# Altium project PhantomPowerSupply_PCBProject.PrjPcb
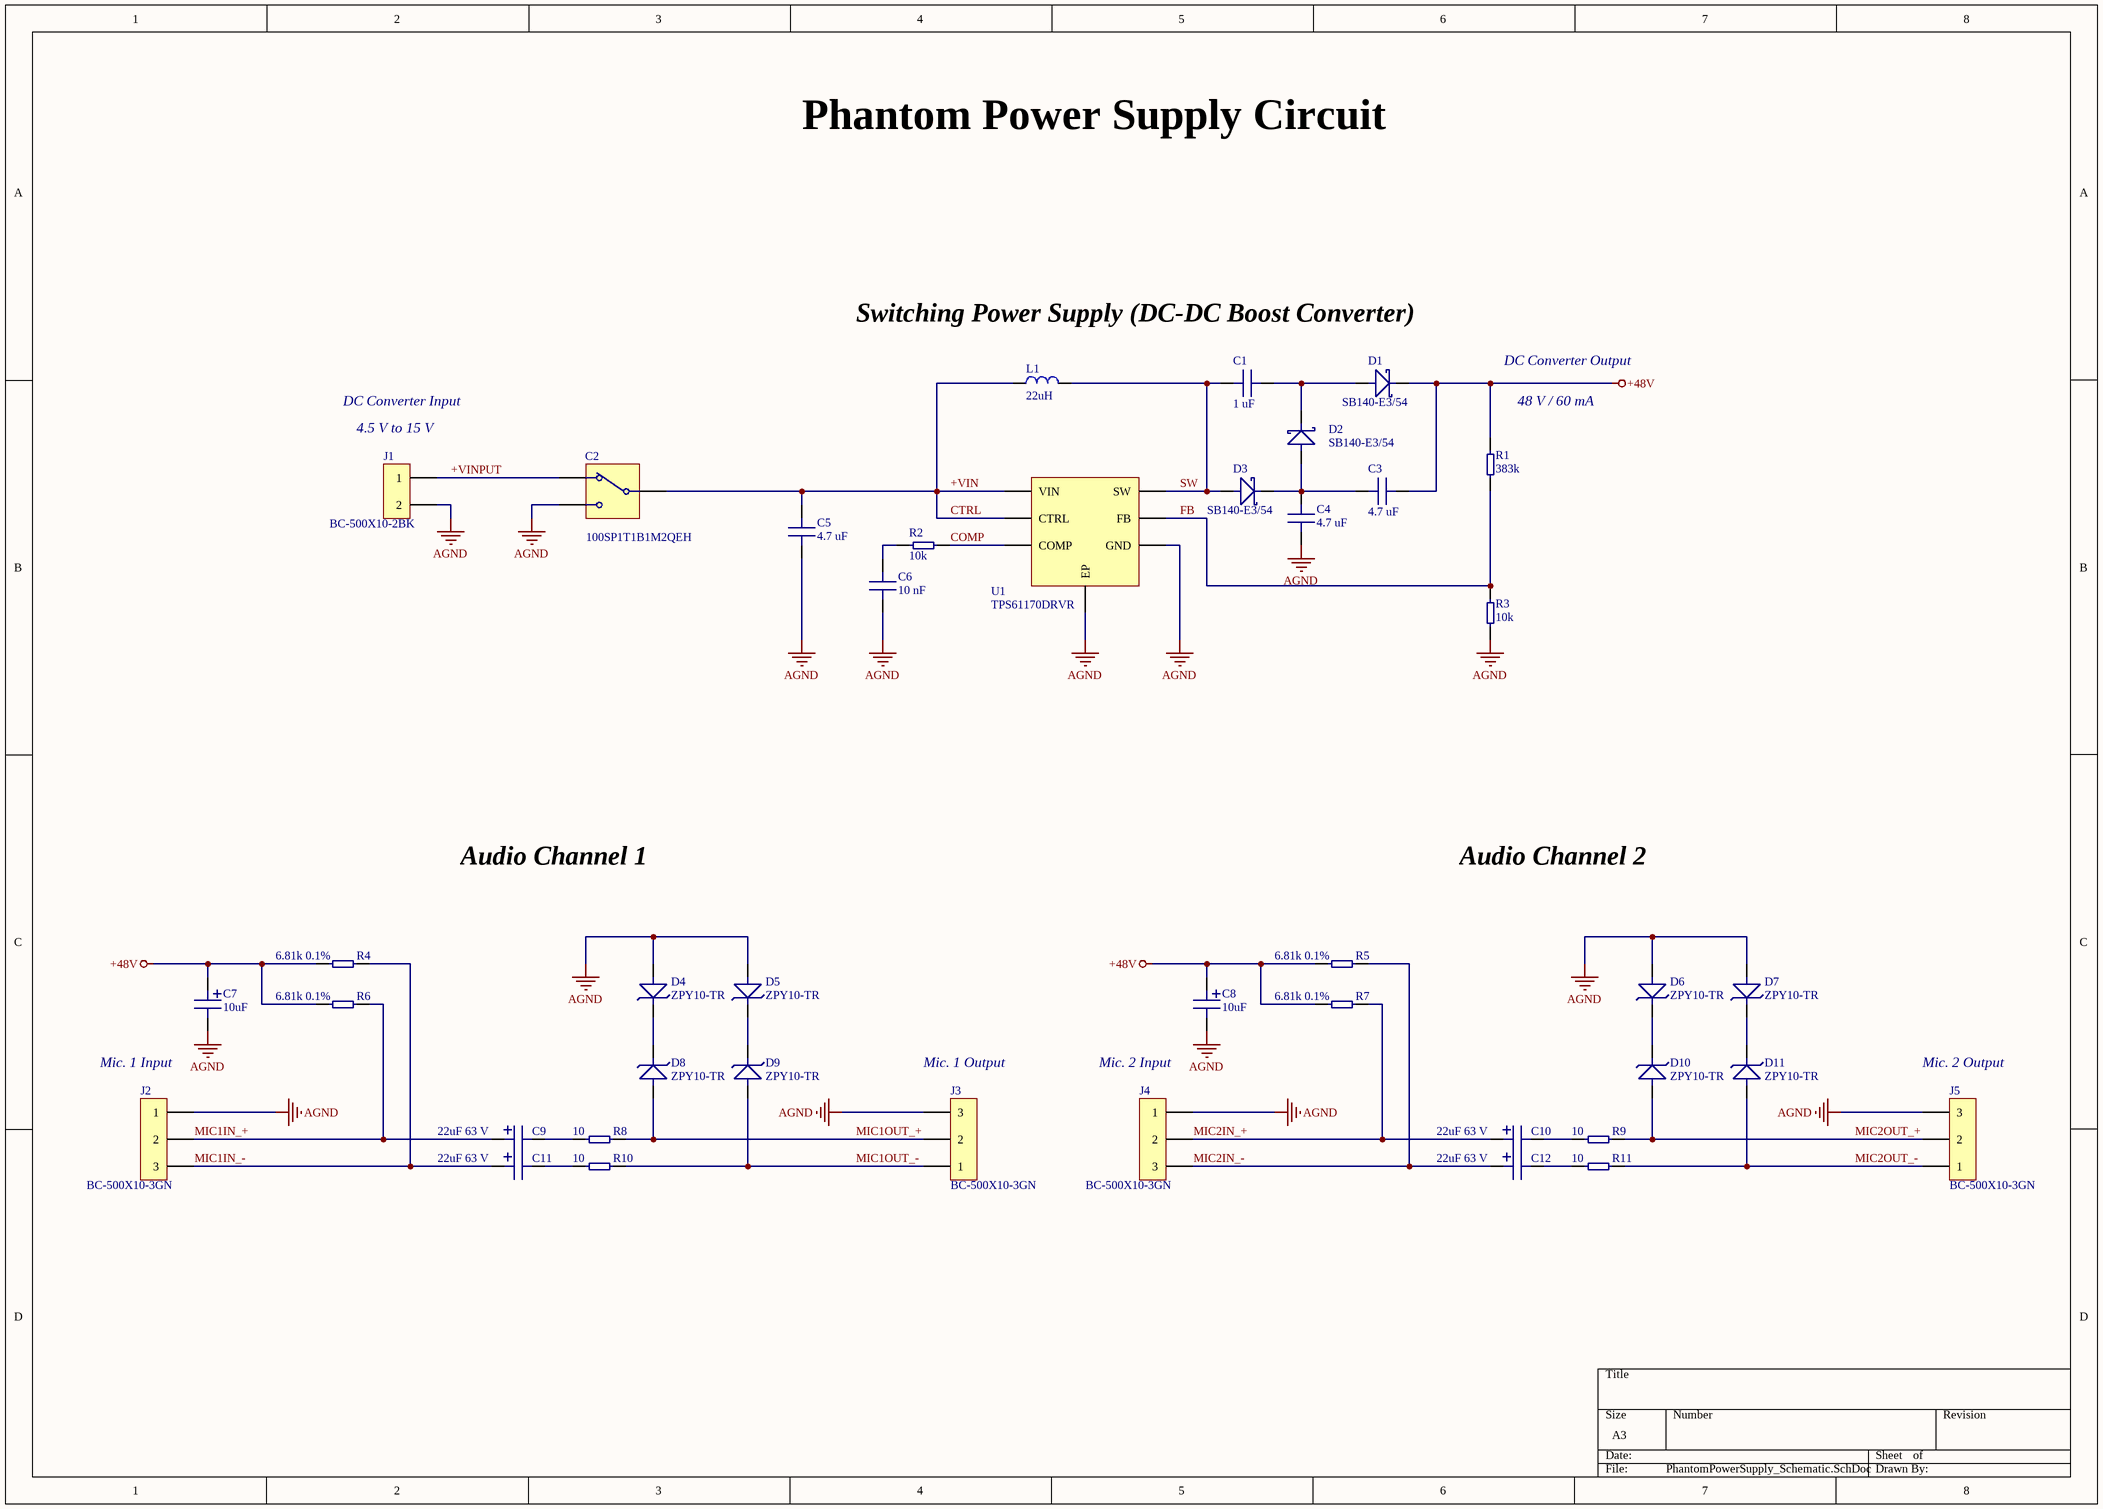
[diagram p0: PhantomPowerSupply_Schematic.SchDoc]
1 sheet, 41 parts. Net scope: global (net labels, ports and power ports of the same name join across sheets).
Board file: PhantomPowerSupply_Board.PcbDoc

## Sheet PhantomPowerSupply_Schematic.SchDoc
size A3

### Parts
C1  1 uF  [CRADIAL-CERAMIC-BROWN]
C2  100SP1T1B1M2QEH  [SPDT-M2]
C3  4.7 uF  [CRADIAL-CERAMIC]
C4  4.7 uF  [CRADIAL-CERAMIC]
C5  4.7 uF  [CRADIAL-CERAMIC]
C6  10 nF  [CRADIAL-CERAMIC-BROWN]
C7  10uF  [C-ELECTROLYTIC-RADIAL]
C8  10uF  [C-ELECTROLYTIC-RADIAL]
C9  22uF 63 V  [C-ELECTROLYTIC-RADIAL]
C10  22uF 63 V  [C-ELECTROLYTIC-RADIAL]
C11  22uF 63 V  [C-ELECTROLYTIC-RADIAL]
C12  22uF 63 V  [C-ELECTROLYTIC-RADIAL]
D1  SB140-E3/54  [D-SCHOTTKY-AXIAL]
D2  SB140-E3/54  [D-SCHOTTKY-AXIAL]
D3  SB140-E3/54  [D-SCHOTTKY-AXIAL]
D4  ZPY10-TR  [D-ZENER-AXIAL]
D5  ZPY10-TR  [D-ZENER-AXIAL]
D6  ZPY10-TR  [D-ZENER-AXIAL]
D7  ZPY10-TR  [D-ZENER-AXIAL]
D8  ZPY10-TR  [D-ZENER-AXIAL]
D9  ZPY10-TR  [D-ZENER-AXIAL]
D10  ZPY10-TR  [D-ZENER-AXIAL]
D11  ZPY10-TR  [D-ZENER-AXIAL]
J1  BC-500X10-2BK  [SCREW-CON-2POS]
J2  BC-500X10-3GN  [SCREW-CON-3POS]
J3  BC-500X10-3GN  [SCREW-CON-3POS]
J4  BC-500X10-3GN  [SCREW-CON-3POS]
J5  BC-500X10-3GN  [SCREW-CON-3POS]
L1  22uH  [L-AXIAL]
R1  383k  [R-AXIAL]
R2  10k  [R-AXIAL]
R3  10k  [R-AXIAL]
R4  6.81k 0.1%  [R-AXIAL]
R5  6.81k 0.1%  [R-AXIAL]
R6  6.81k 0.1%  [R-AXIAL]
R7  6.81k 0.1%  [R-AXIAL]
R8  10  [R-AXIAL]
R9  10  [R-AXIAL]
R10  10  [R-AXIAL]
R11  10  [R-AXIAL]
U1  TPS61170DRVR  [S-PWSON-N6]

### Nets
+48V: C3.2 C7.1 C8.1 D1.2 R1.2 R4.1 R5.1 R6.1 R7.1
AGND: C2.3 C4.1 C5.1 C6.1 C7.2 C8.2 D4.1 D5.1 D6.1 D7.1 J1.2 J2.1 J3.3 J4.1 J5.3 R3.1 U1.3(GND) U1.7(EP)
+VIN: C2.2 C5.2 L1.1 U1.5(CTRL) U1.6(VIN)  [also labelled CTRL]
+VINPUT: C2.1 J1.1
COMP: R2.2 U1.2(COMP)
FB: R1.1 R3.2 U1.1(FB)
MIC1IN_+: C9.1 J2.2 R6.2
MIC1IN_-: C11.1 J2.3 R4.2
MIC1OUT_+: D8.1 J3.2 R8.2
MIC1OUT_-: D9.1 J3.1 R10.2
MIC2IN_+: C10.1 J4.2 R7.2
MIC2IN_-: C12.1 J4.3 R5.2
MIC2OUT_+: D10.1 J5.2 R9.2
MIC2OUT_-: D11.1 J5.1 R11.2
SW: C1.1 D3.1 L1.2 U1.4(SW)
NetC1_2: C1.2 D1.1 D2.2
NetC3_1: C3.1 C4.2 D2.1 D3.2
NetC6_2: C6.2 R2.1
NetC9_2: C9.2 R8.1
NetC10_2: C10.2 R9.1
NetC11_2: C11.2 R10.1
NetC12_2: C12.2 R11.1
NetD4_2: D4.2 D8.2
NetD5_2: D5.2 D9.2
NetD6_2: D6.2 D10.2
NetD7_2: D7.2 D11.2

### Notes on the sheet
- Phantom Power Supply Circuit
- Switching Power Supply (DC-DC Boost Converter)
- DC Converter Output
- DC Converter Input
- (near J1) 4.5 V to 15 V
- (near R1) 48 V / 60 mA
- Audio Channel 1
- Audio Channel 2
- Mic. 1 Input
- (near J3) Mic. 1 Output
- Mic. 2 Input
- (near J5) Mic. 2 Output

### Library data of the parts
C1 = K105K20X7RF5TH5: Multilayer Ceramic Capacitors MLCC - Leaded 1uF 50volts 10% X7R 5mm LS; Manufacturer: Vishay / BC Components; Voltage Rating: 50 V; Case Style: Dipped; Lead Diameter: 0.5 mm; Supplier 1: Mouser; Manufacturer Part Number: K105K20X7RF5TH5; RoHS: RoHS Compliant By Exemption; Category: Multilayer Ceramic Capacitors MLCC - Leaded; Stock 1: 11553; Pricing 1: 1=0.312, 3000=0.166, 6000=0.150, 15000=0.141, 30000=0.131 (EUR); Capacitance: 1 uF; Operating Temperature Range: - 55 C to + 125 C; Packaging: Reel; Product: General Type MLCCs; Series: K; Termination Style: Radial; Tolerance: 10 %; Voltage Rating DC: 50 V; Brand: Vishay / BC Components; Case Height: 5 mm; Case Length: 5 mm; Case Width: 5 mm; Lead Spacing: 5 mm; Lead Style: Outside Bend; Maximum Operating Temperature: + 125 C; Minimum Operating Temperature: - 55 C; Product Category: Ceramic Capacitors; Temperature Coefficient/Code: X7R; Tradename: Mono-Kap; RoHS - Mouser: E; Minimum Order Quantity: 1; Reeling: True; ComponentLink1URL: http://www.mouser.com/ds/2/427/mkseries-205465.pdf; ComponentLink1Description: http://www.mouser.com/ds/2/427/mkseries-205465.pdf
C2 = 100SP1T1B1M2QEH: Toggle Switches SPDT ON-ON PC MNT; Manufacturer: E-Switch; Actuator: Bat; Current Rating: 4 A; Illumination: None; Switch Function: ON - NONE - ON; Voltage Rating AC: 250 V; Voltage Rating DC: 28 V; Supplier 1: Mouser; Manufacturer Part Number: 100SP1T1B1M2QEH; RoHS: RoHS Compliant; Category: Toggle Switches; Stock 1: 1386; Pricing 1: 1=1.69, 10=1.62, 25=1.54, 50=1.48, 100=1.34, 250=1.23, 500=1.13 (EUR); Bushing Size: 1/4-40; Contact Form: SPDT; Contact Plating: Silver; Series: 100; Terminal Seal: Sealed; Termination Style: Solder Pin; Brand: E-Switch; Mounting Style: Through Hole; Product Category: Toggle Switches; RoHS - Mouser: Y; Minimum Order Quantity: 1; Reeling: False; ComponentLink1URL: http://www.mouser.com/ds/2/140/100-346274.pdf; ComponentLink1Description: http://www.mouser.com/ds/2/140/100-346274.pdf
C3-C5 = FK11X7R1H475K: Multilayer Ceramic Capacitors MLCC - Leaded 4.7uF 50volts X7R +/-10%; Manufacturer: TDK; Tolerance: 10 %; Type: Dipped Radial Lead Commercial Grade; Voltage Rating: 50 V; Case Style: Dipped; Case Height: 4 mm; Case Length: 5.5 mm; Case Width: 7 mm; Lead Diameter: 0.5 mm; Supplier 1: Mouser; Manufacturer Part Number: FK11X7R1H475K; RoHS: RoHS Compliant; Category: Multilayer Ceramic Capacitors MLCC - Leaded; Stock 1: 12031; Pricing 1: 1=0.784, 10=0.602, 100=0.334, 1000=0.287, 2500=0.254, 10000=0.246, 25000=0.236, 50000=0.231 (EUR); Capacitance: 4.7 uF; Operating Temperature Range: - 55 C to + 125 C; Packaging: Bulk; Product: General Type MLCCs; Series: FK; Termination Style: Radial; Voltage Rating DC: 50 V; Brand: TDK; Lead Spacing: 2.5 mm; Maximum Operating Temperature: + 125 C; Minimum Operating Temperature: - 55 C; Standard Pack Qty: 500; Temperature Coefficient/Code: X7R; RoHS - Mouser: Y; Minimum Order Quantity: 1; Reeling: False; ComponentLink1URL: http://www.mouser.com/ds/2/400/tdk_lowvoltageleadmlcc_commercial_general_en-347111.pdf; ComponentLink1Description: http://www.mouser.com/ds/2/400/tdk_lowvoltageleadmlcc_commercial_general_en-347111.pdf
C6 = K103K15X7RF5UH5: Multilayer Ceramic Capacitors MLCC - Leaded .01uF 50volts 10% 5.0mm X7R; Manufacturer: Vishay / BC Components; Capacitance: 0.01 uF; Voltage Rating: 50 V; Case Style: Dipped; Case Width: 2.5 mm; Product Status: New at Mouser; Supplier 1: Mouser; Manufacturer Part Number: K103K15X7RF5UH5; RoHS: RoHS Compliant; Category: Multilayer Ceramic Capacitors MLCC - Leaded; Stock 1: 19645; Pricing 1: 1=0.032, 100=0.024, 2500=0.024, 5000=0.016 (EUR); Operating Temperature Range: - 55 C to + 125 C; Packaging: Ammo Pack; Product: General Type MLCCs; Termination Style: Radial; Tolerance: 10 %; Voltage Rating DC: 50 V; Brand: Vishay / BC Components; Maximum Operating Temperature: + 125 C; Minimum Operating Temperature: - 55 C; Product Category: Dipped Radial Ceramic Capacitor; Standard Pack Qty: 2500; RoHS - Mouser: Y; Minimum Order Quantity: 1; Reeling: False; ComponentLink1URL: http://www.mouser.com/catalog/specsheets/mkseries.pdf; ComponentLink1Description: http://www.mouser.com/catalog/specsheets/mkseries.pdf
C7 C8 = REA100M1HBK-0511P: Aluminium Electrolytic Capacitors - Leaded 50V 10uF 20% 5x11mm; Manufacturer: Lelon; Case Diameter: 5 mm; Case Length: 11 mm; Dissipation Factor DF: 0.1; Load Life: 2000 h; Ripple Current: 65 mA; Supplier 1: Mouser; Manufacturer Part Number: REA100M1HBK-0511P; RoHS: RoHS Compliant; Category: Aluminium Electrolytic Capacitors - Leaded; Stock 1: 39187; Pricing 1: 1=0.064, 10=0.062, 100=0.054, 500=0.041, 1000=0.039, 2000=0.032, 5000=0.028, 10000=0.025, 25000=0.017 (EUR); Capacitance: 10 uF; Dimensions: 5 mm Dia. x 11 mm L; Product: General Purpose Electrolytic Capacitors; Series: REA; Termination Style: Radial; Tolerance: 20 %; Voltage Rating DC: 50 V; Brand: Lelon; Lead Spacing: 2 mm; Maximum Operating Temperature: + 85 C; Product Category: Radial Electrolytic Capacitors; Standard Pack Qty: 500; RoHS - Mouser: Y; Minimum Order Quantity: 1; Reeling: False; ComponentLink1URL: http://www.mouser.com/catalog/specsheets/lelon_REA[1].pdf; ComponentLink1Description: http://www.mouser.com/catalog/specsheets/lelon_REA[1].pdf
C9-C12 = REA220M1JBK-0611P: Aluminium Electrolytic Capacitors - Leaded 63V 22uF 20% 6.3x11 mm; Manufacturer: Lelon; Case Diameter: 6.3 mm; Case Length: 11 mm; Dissipation Factor DF: 0.09; Load Life: 2000 h; Ripple Current: 115 mA; Product Status: Factory Special Order; Supplier 1: Mouser; Manufacturer Part Number: REA220M1JBK-0611P; RoHS: RoHS Compliant; Category: Aluminium Electrolytic Capacitors - Leaded; Stock 1: 9296; Pricing 1: 1=0.072, 10=0.066, 100=0.053, 500=0.040, 1000=0.038, 2000=0.033, 5000=0.027, 10000=0.024, 25000=0.022 (EUR); Capacitance: 22 uF; Dimensions: 6.3 mm Dia. x 11 mm L; Packaging: Bulk; Product: General Purpose Electrolytic Capacitors; Series: REA; Termination Style: Radial; Tolerance: 20 %; Voltage Rating DC: 63 V; Brand: Lelon; Lead Spacing: 2.5 mm; Maximum Operating Temperature: + 85 C; Product Category: Radial Electrolytic Capacitors; Standard Pack Qty: 1000; RoHS - Mouser: Y; Minimum Order Quantity: 1; Reeling: False; ComponentLink1URL: http://www.mouser.com/catalog/specsheets/lelon_REA[1].pdf; ComponentLink1Description: http://www.mouser.com/catalog/specsheets/lelon_REA[1].pdf
D1-D3 = SB140-E3/54: Schottky Diodes & Rectifiers 40 Volt 1.0 Amp 50 Amp IFSM; Manufacturer: Vishay Semiconductors; Configuration: Single; Forward Continuous Current: 1 A; Max Surge Current: 50 A; Forward Voltage Drop: 0.48 V; Maximum Reverse Leakage Current: 500 uA; Peak Reverse Voltage: 40 V; Supplier 1: Mouser; Manufacturer Part Number: SB140-E3/54; RoHS: RoHS Compliant By Exemption; Category: Schottky Diodes & Rectifiers; Stock 1: 11660; Pricing 1: 1=0.096, 5500=0.096 (EUR); Operating Temperature Range: - 65 C to + 125 C; Package/Case: DO-204AL; Packaging: Reel; Product: Schottky Diodes; Brand: Vishay Semiconductors; Mounting Style: Through Hole; Product Category: Schottky Rectifiers; Standard Pack Qty: 5500; RoHS - Mouser: E; Minimum Order Quantity: 1; Reeling: True; ComponentLink1URL: http://www.mouser.com/ds/2/427/88715-108282.pdf; ComponentLink1Description: http://www.mouser.com/ds/2/427/88715-108282.pdf
D4-D11 = ZPY10-TR: Zener Diodes 10 Volt 1.3 Watt 5%; Manufacturer: Vishay Semiconductors; Configuration: Single; Power Dissipation: 1.3 W; Zener Current: 105 mA; Maximum Zener Impedance: 4 Ohms; Voltage Temperature Coefficient: 0.07 %/C; Voltage Tolerance: 6 %; Zener Voltage: 10.005 V; Supplier 1: Mouser; Manufacturer Part Number: ZPY10-TR; RoHS: RoHS Compliant By Exemption; Category: Zener Diodes; Stock 1: 17165; Pricing 1: 1=0.080, 10=0.056, 100=0.055, 500=0.047, 1000=0.046, 5000=0.045, 10000=0.042, 25000=0.039 (EUR); Package/Case: DO-41; Packaging: Reel; Brand: Vishay Semiconductors; Mounting Style: Through Hole; Maximum Operating Temperature: + 175 C; Minimum Operating Temperature: - 55 C; Product Category: Zener Diodes; Standard Pack Qty: 5000; RoHS - Mouser: E; Minimum Order Quantity: 1; Reeling: True; ComponentLink1URL: http://www.mouser.com/ds/2/427/zpy3v9-108163.pdf; ComponentLink1Description: http://www.mouser.com/ds/2/427/zpy3v9-108163.pdf
J1 = 5441537: Fixed Terminal Blocks BC-500X10- 2 BK; Manufacturer: Phoenix Contact; Connection Method: Screw; Current Rating: 13.5 A; Number of Positions: 2; Voltage Rating: 400 V; Pitch: 5 mm; Wire Gauge Range: 26-16; Wire Gauge Max: 16; Wire Gauge Min: 26; Product Status: New Product; Supplier 1: Mouser; Manufacturer Part Number: 5441537; RoHS: RoHS Compliant; Category: Fixed Terminal Blocks; Stock 1: 88; Pricing 1: 1=0.704, 10=0.672, 25=0.664, 50=0.656, 100=0.614, 250=0.565, 500=0.522, 1000=0.499 (EUR); Color: Black; Contact Plating: Tin; Housing Material: Polyamide (PA); Length: 5 mm; Mounting Method: -; Series: BC; Termination Style: Through Hole; Brand: Phoenix Contact; Flammability Rating: UL 94 V-0; Standard Pack Qty: 100; Tradename: BASICLINE; RoHS - Mouser: Y; Minimum Order Quantity: 1; Reeling: False; ComponentLink1URL: http://www.phoenixcontact.com/us/products/5441537/pdf; ComponentLink1Description: http://www.phoenixcontact.com/us/products/5441537/pdf
J2-J5 = 5442183: Fixed Terminal Blocks BC-500X10- 3 GN 5.00 MM PITCH; Manufacturer: Phoenix Contact; Connection Method: Screw; Current Rating: 13.5 A; Number of Positions: 3; Voltage Rating: 400 V; Pitch: 5 mm; Wire Gauge Range: 26-16; Wire Orientation: 0 deg; Product Status: New Product; Supplier 1: Mouser; Manufacturer Part Number: 5442183; RoHS: RoHS Compliant; Category: Fixed Terminal Blocks; Stock 1: 314; Pricing 1: 1=1.04, 10=1.00, 25=0.984, 50=0.976, 100=0.912, 250=0.840, 500=0.776, 1000=0.742 (EUR); Color: Green; Contact Plating: Tin; Series: BC; Termination Style: Through Hole; Brand: Phoenix Contact; Flammability Rating: UL 94 V-0; Standard Pack Qty: 100; Tradename: BASICLINE; RoHS - Mouser: Y; Minimum Order Quantity: 1; Reeling: False; ComponentLink1URL: http://www.phoenixcontact.com/us/products/5442183/pdf; ComponentLink1Description: http://www.phoenixcontact.com/us/products/5442183/pdf
L1 = 78F220J-RC: Fixed Inductors 22uH 5%; Manufacturer: J.W. Miller; Core Material: Ferrite; Maximum DC Current: 285 mA; Maximum DC Resistance: 1.2 Ohms; Q Minimum: 50; Self Resonant Frequency: 13 MHz; Type: Conformal Coated Chokes; Case Diameter: 0.11 in; Case Length: 0.28 in; Test Frequency: 2.5 MHz; Supplier 1: Mouser; Manufacturer Part Number: 78F220J-RC; RoHS: RoHS Compliant; Category: Fixed Inductors; Stock 1: 8659; Pricing 1: 1=0.176, 10=0.138, 100=0.108, 500=0.092, 1000=0.078 (EUR); Inductance: 22 uH; Operating Temperature Range: - 20 C to + 105 C; Series: 78F; Termination Style: Axial; Tolerance: 5 %; Brand: J.W. Miller; Product Category: Conformal Coated Chokes; Standard Pack Qty: 5000; RoHS - Mouser: Y; Minimum Order Quantity: 1; Reeling: False; ComponentLink1URL: http://www.mouser.com/ds/2/54/78F_series-42602.pdf; ComponentLink1Description: http://www.mouser.com/ds/2/54/78F_series-42602.pdf
R1 = MF1/4DCT26A3833F: Metal Film Resistors - Through Hole 1/4 WATT 383K OHM 1%; Manufacturer: KOA Speer; Power Rating: 250 mW (1/4 W); Resistance: 383 kOhms; Temperature Coefficient: 100 PPM / C; Case Diameter: 2.3 mm; Case Length: 7.1 mm; Supplier 1: Mouser; Manufacturer Part Number: MF1/4DCT26A3833F; RoHS: RoHS Compliant; Category: Metal Film Resistors - Through Hole; Stock 1: 5660; Pricing 1: 1=0.064, 100=0.032, 1000=0.022, 2000=0.022, 4000=0.016, 10000=0.012, 24000=0.009, 50000=0.006, 250000=0.005 (EUR); Operating Temperature Range: - 55 C to + 155 C; Packaging: Ammo Pack; Product: Metal Film Resistors General Purpose; Series: MF; Termination Style: Axial; Tolerance: 1 %; Type: Semi-precision metal film resistors; Brand: KOA Speer; Lead Spacing: 30 mm; Product Category: 1/4Watt Metal Film Resistors; Standard Pack Qty: 2000; RoHS - Mouser: Y; Minimum Order Quantity: 1; Reeling: False; ComponentLink1URL: http://www.koaspeer.com/catimages/Products/MF-MFS-RK/MF-MFS-RK.pdf; ComponentLink1Description: http://www.koaspeer.com/catimages/Products/MF-MFS-RK/MF-MFS-RK.pdf
R2 R3 = MF1/4DCT52A1002F: Metal Film Resistors - Through Hole 1/4 WATT 10K OHM 1%; Manufacturer: KOA Speer; Power Rating: 250 mW (1/4 W); Resistance: 10 kOhms; Temperature Coefficient: 100 PPM / C; Case Diameter: 2.3 mm; Case Length: 7.1 mm; Supplier 1: Mouser; Manufacturer Part Number: MF1/4DCT52A1002F; RoHS: RoHS Compliant; Category: Metal Film Resistors - Through Hole; Stock 1: 62471; Pricing 1: 1=0.064, 100=0.032, 1000=0.022, 5000=0.016, 10000=0.012, 25000=0.009, 50000=0.006, 250000=0.005 (EUR); Packaging: Ammo Pack; Product: Metal Film Resistors General Purpose; Termination Style: Axial; Tolerance: 1 %; Brand: KOA Speer; Product Category: 1/4Watt Metal Film Resistors; Standard Pack Qty: 5000; RoHS - Mouser: Y; Minimum Order Quantity: 1; Reeling: False; ComponentLink1URL: http://www.koaspeer.com/catimages/Products/MF-MFS-RK/MF-MFS-RK.pdf; ComponentLink1Description: http://www.koaspeer.com/catimages/Products/MF-MFS-RK/MF-MFS-RK.pdf
R4-R7 = RN55E6811BRE6: Metal Film Resistors - Through Hole 1/10watt 6.81Kohms .1% 25ppm; Manufacturer: Vishay / Dale; Power Rating: 125 mW (1/8 W); Temperature Coefficient: 25 PPM / C; Voltage Rating: 200 V; Case Diameter: 2.29 mm; Case Length: 6.1 mm; Lead Diameter: 0.64 mm; Supplier 1: Mouser; Manufacturer Part Number: RN55E6811BRE6; RoHS: No; Category: Metal Film Resistors - Through Hole; Stock 1: 823; Pricing 1: 1=0.416, 50=0.376, 100=0.320, 500=0.304, 1000=0.288, 2000=0.240, 5000=0.216 (EUR); Operating Temperature Range: - 65 C to + 175 C; Packaging: Reel; Product: Precision Metal Film Resistors; Resistance: 6.81 kOhms; Series: RN; Termination Style: Axial; Tolerance: 0.1 %; Type: Military Precision Metal Film Resistors; Brand: Vishay / Dale; Product Category: Metal Film Resistors; Standard Pack Qty: 1000; RoHS - Mouser: N; Minimum Order Quantity: 1; Reeling: True; ComponentLink1URL: http://www.vishay.com/doc?31027; ComponentLink1Description: http://www.vishay.com/doc?31027
R8-R11 = FRM-50JT-52-10R: Metal Film Resistors - Through Hole 10 OHM 1/2W 5%; Manufacturer: Yageo; Power Rating: 500 mW (1/2 W); Resistance: 10 Ohms; Temperature Coefficient: 200 PPM / C; Voltage Rating: 250 V; Case Diameter: 3.3 mm; Case Length: 9 mm; Lead Diameter: 0.55 mm; Supplier 1: Mouser; Manufacturer Part Number: FRM-50JT-52-10R; RoHS: RoHS Compliant; Category: Metal Film Resistors - Through Hole; Stock 1: 3950; Pricing 1: 1=0.032, 1000=0.024, 2000=0.017, 5000=0.015, 25000=0.014, 100000=0.013 (EUR); Operating Temperature Range: - 55 C to + 155 C; Packaging: Ammo Pack; Product: Metal Film Resistors Flameproof; Series: FRM; Termination Style: Axial; Tolerance: 5 %; Type: Fusible and Flame Proof Type Normal and Miniature Style; Brand: Yageo; Product Category: Metal Film Resistors; RoHS - Mouser: Y; Minimum Order Quantity: 1; Reeling: False; ComponentLink1URL: http://www.mouser.com/ds/2/447/Leaded-R_2011-336584.pdf; ComponentLink1Description: http://www.mouser.com/ds/2/447/Leaded-R_2011-336584.pdf
U1 = TPS61170DRVR: Voltage Regulators - Switching Regulators 1.2A Sw Hi Vltg Boost Conv; Manufacturer: Texas Instruments; Input Voltage MAX: 18 V; Number of Outputs: 1 Output; Output Voltage: 3 V to 38 V; Switching Frequency: 1.2 MHz; Supplier 1: Mouser; Manufacturer Part Number: TPS61170DRVR; RoHS: RoHS Compliant; Category: Voltage Regulators - Switching Regulators; Stock 1: 12732; Pricing 1: 1=2.42, 10=2.16, 25=1.94, 50=1.86, 100=1.77, 250=1.59, 500=1.43, 750=1.30, 1000=1.25, 3000=1.25 (EUR); Output Current: 1.2 A; Package/Case: WSON-6; Packaging: Reel; Series: TPS61170; Type: Step-Down Regulator; Brand: Texas Instruments; Mounting Style: SMD/SMT; Product Category: Converters - DC/DC; Standard Pack Qty: 3000; RoHS - Mouser: Y; Minimum Order Quantity: 1; Reeling: True; ComponentLink1URL: http://www.mouser.com/ds/2/405/slvs789c-118222.pdf; ComponentLink1Description: http://www.mouser.com/ds/2/405/slvs789c-118222.pdf